# Altium schematic sheet Schema2.SchDoc: Olimex Interface Board
size A4; DrawnBy: Coen de Boer; Engineer: Coen de Boer; Revision: 2005-H
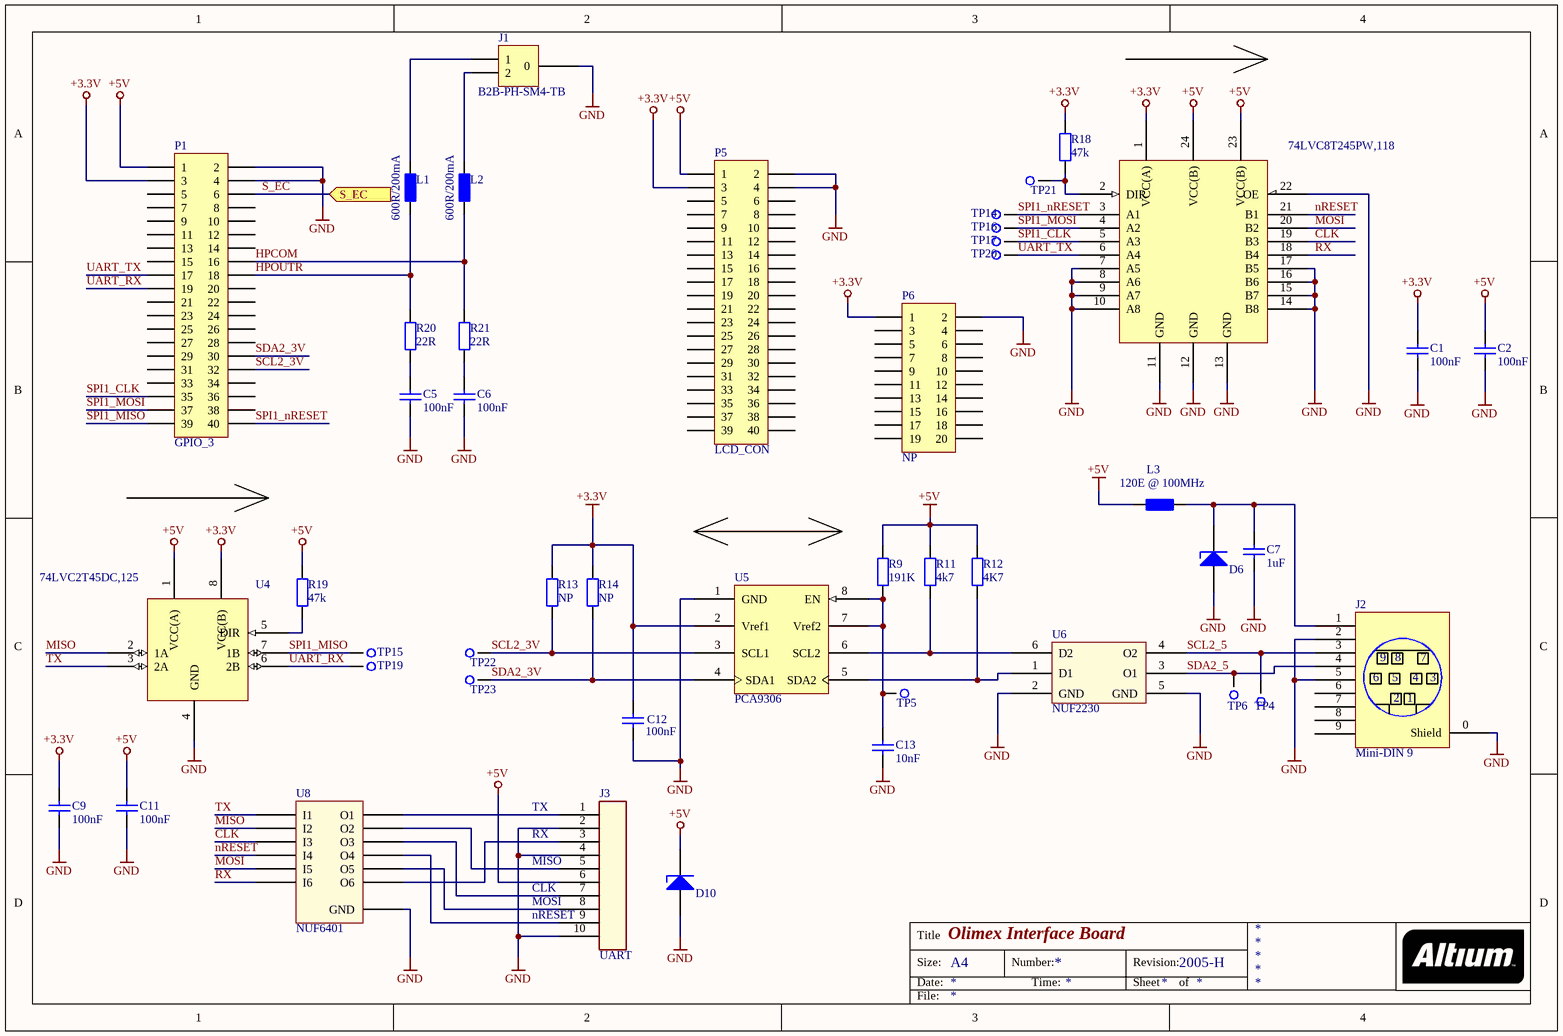
[diagram p0: Schema2.SchDoc]

## Parts
C1  100nF  [C0805 (2012)]
C2  100nF  [C0805 (2012)]
C5  100nF  [C0805 (2012)]
C6  100nF  [C0805 (2012)]
C7  1uF  [CAPC1608X09N]
C9  100nF  [C0805 (2012)]
C11  100nF  [C0805 (2012)]
C12  100nF  [C0805 (2012)]
C13  10nF  [C0805 (2012)]
D6  ESD9X5.0ST5G  [SODFL100X40-2N]  (value not drawn)
D10  ESD9X5.0ST5G  [SODFL100X40-2N]  (value not drawn)
J1  B2B-PH-SM4-TB  [B2B-PH-SM4-TB]
J2  Mini-DIN 9  [MD-90SM]
J3  UART  [BOXHEADER-10P-straight]
L1  600R/200mA  [R0805]
L2  600R/200mA  [R0805]
L3  120E @ 100MHz  [R0603]
P1  GPIO_3  [M50-3152042]
P5  LCD_CON  [M50-3152042]
P6  NP  [HARWIN M20]
R9  191K  [R0805 (2012)]
R11  4k7  [RESC1608X05N]
R12  4K7  [RESC1608X05N]
R13  NP  [R0805 (2012)]
R14  NP  [R0805 (2012)]
R18  47k  [RESC1608X05N]
R19  47k  [RESC1608X05N]
R20  22R  [RESC1608X05N]
R21  22R  [RESC1608X05N]
TP4  2mm  [TESTPOINT 2mm]  (value not drawn)  (no BOM)
TP5  2mm  [TESTPOINT 2mm]  (value not drawn)  (no BOM)
TP6  2mm  [TESTPOINT 2mm]  (value not drawn)  (no BOM)
TP14  2mm  [TESTPOINT 2mm]  (value not drawn)  (no BOM)
TP15  2mm  [TESTPOINT 2mm]  (value not drawn)  (no BOM)
TP16  2mm  [TESTPOINT 2mm]  (value not drawn)  (no BOM)
TP17  2mm  [TESTPOINT 2mm]  (value not drawn)  (no BOM)
TP19  2mm  [TESTPOINT 2mm]  (value not drawn)  (no BOM)
TP20  2mm  [TESTPOINT 2mm]  (value not drawn)  (no BOM)
TP21  2mm  [TESTPOINT 2mm]  (value not drawn)  (no BOM)
TP22  2mm  [TESTPOINT 2mm]  (value not drawn)  (no BOM)
TP23  2mm  [TESTPOINT 2mm]  (value not drawn)  (no BOM)
U3  74LVC8T245PW,118  [TSOP65P640X110-24N]
U4  74LVC2T45DC,125  [TSSOP50P310X100-8N]
U5  PCA9306  [IC SSOP-8]
U6  NUF2230  [SOTFL50P160X60-6N]
U8  NUF6401  [SON50P140X100_HS-13N]

## Ports
S_EC (in)

## Nets
+3.3V: C1.1 C9.1 C12.2 P1.3 P5.3 P6.1 R13.2 R14.2 R18.1 U3.1(VCC(A)) U4.8(VCC(B)) U5.2(Vref1)
+5V: C2.1 C11.1 D10.1(K) J3.6 L3.1 P1.1 P5.1 R9.2 R11.2 R12.2 R19.1 U3.23(VCC(B)) U3.24(VCC(B)) U4.1(VCC(A))
GND: C1.2 C2.2 C5.2 C6.2 C7.1 C9.2 C11.2 C12.1 C13.1 D6.2(A) D10.2(A) J1.0 J2.0(Shield) J2.2 J2.5 J3.2 J3.4 J3.10 P1.2 P1.4 P5.2 P5.4 P6.2 U3.7(A5) U3.8(A6) U3.9(A7) U3.10(A8) U3.11(GND) U3.12(GND) U3.13(GND) U3.14(B8) U3.15(B7) U3.16(B6) U3.17(B5) U3.22(OE) U4.4(GND) U5.1(GND) U6.2(GND) U6.5(GND) U8.13(GND)
CLK: U3.19(B3) U8.3(I3)
HPCOM: L2.1 P1.16 R21.2
HPOUTR: L1.1 P1.18 R20.2
MISO: U4.2(1A) U8.2(I2)
MOSI: U3.20(B2) U8.5(I5)
nRESET: U3.21(B1) U8.4(I4)
RX: U3.18(B4) U8.6(I6)
S_EC: P1.6 ; port S_EC
SCL2_3V: P1.32 R13.1 TP22.1 U5.3(SCL1)
SCL2_5: J2.3 TP4.1 U6.4(O2)
SDA2_3V: P1.30 R14.1 TP23.1 U5.4(SDA1)
SDA2_5: J2.4 TP6.1 U6.3(O1)
SPI1_CLK: P1.35 TP17.1 U3.5(A3)
SPI1_MISO: P1.39 TP15.1 U4.7(1B)
SPI1_MOSI: P1.37 TP16.1 U3.4(A2)
SPI1_nRESET: P1.40 TP14.1 U3.3(A1)
TX: U4.3(2A) U8.1(I1)
UART_RX: P1.19 TP19.1 U4.6(2B)
UART_TX: P1.17 TP20.1 U3.6(A4)
NetC5_1: C5.1 R20.1
NetC6_1: C6.1 R21.1
NetC7_2: C7.2 D6.1(K) J2.1 L3.2
NetC13_2: C13.2 R9.1 TP5.1 U5.7(Vref2) U5.8(EN)
NetJ1_1: J1.1 L1.2
NetJ1_2: J1.2 L2.2
NetJ3_1: J3.1 U8.12(O1)
NetJ3_3: J3.3 U8.7(O6)
NetJ3_5: J3.5 U8.11(O2)
NetJ3_7: J3.7 U8.10(O3)
NetJ3_8: J3.8 U8.8(O5)
NetJ3_9: J3.9 U8.9(O4)
NetR11_1: R11.1 U5.6(SCL2) U6.6(D2)
NetR12_1: R12.1 U5.5(SDA2) U6.1(D1)
NetR18_2: R18.2 TP21.1 U3.2(DIR)
NetR19_2: R19.2 U4.5(DIR)

Not connected (* = marked no-connect by the designer): J2 6 7 8 9; P1 5 7 8 9 10 11 12 13 14 15 20 21 22 23 24 25 26 27 28 29 31 33 34 36 38; P5 5 6 7 8 9 10 11 12 13 14 15 16 17 18 19 20 21 22 23 24 25 26 27 28 29 30 31 32 33 34 35 36 37 38 39 40; P6 3 4 5 6 7 8 9 10 11 12 13 14 15 16 17 18 19 20

## Notes on the sheet
- RX
- TX
- (near J3) MISO
- (near J3) CLK
- (near J3) MOSI
- (near J3) nRESET
- Title
- Size:
- Date:
- A4
- Number:
- Time:
- Revision:
- Sheet
- of
- File:

## Library data of the parts
C1 C2 C5 C6 C9 C11 C12 = Cap 100nF X7R 0805: Cap 100nF X7R 0805 10% 100V; Mfg: AVX; Mfg code: 08051C104K4T2A; Faber ItemCode: -; Max soldering temp: -; Remarks: -; Supplier: Farnell; Supplier code: 1833888; Value: 100nF; SMD: Yes
C7 = 1uF/10V/0603: CAP CER 1UF 10V 10% X5R 0603; Manufacturer: Murata Electronics North America; Manufacturer Part Number: GRM188R61A105KA61D; Capacitance: 1.0µF; Value: 1uF; Voltage - Rated: 10V; Supplier 1: Digi-Key; Supplier Part Number 1: 490-1543-6-ND; RoHS: RoHS Compliant; Category: Capacitors; Stock 1: 649155; Pricing 1: 1=0.15, 10=0.063, 50=0.0344, 100=0.0291, 250=0.02372, 500=0.02032, 1000=0.01583 (EUR); Tolerance: ±10%; Temperature Coefficient: X5R; Mounting Type: Surface Mount, MLCC; Operating Temperature: -55°C ~ 85°C; Applications: General Purpose; Ratings: -; Package / Case: 0603 (1608 Metric); Size / Dimension: 0.063" L x 0.031" W (1.60mm x 0.80mm); Height - Seated (Max): -; Thickness (Max): 0.035" (0.90mm); Lead Spacing: -; Features: -; Packaging: Digi-Reel®; Lead Style: -; ComponentLink1URL: http://psearch.murata.com/capacitor/product/GRM188R61A105KA61#.pdf; ComponentLink1Description: http://psearch.murata.com/capacitor/product/GRM188R61A105KA61#.pdf; Mfg: Murata Electronics North America; Mfg code: GRM188R61A105KA61D
C13 = Cap 10nF X7R 0805: Cap 10nF X7R 0805 10% 100V; Mfg: AVX; Mfg code: 08051C103K4Z2A; Faber ItemCode: -; Max soldering temp: -; Remarks: -; Supplier: Farnell; Supplier code: 1833850; SMD: Yes; Value: 10nF
D6 D10 = ESD9X5.0ST5G: TVS DIODE 5VWM 12.3VC SOD923; Mfg: ON Semiconductor; Type: Zener; Unidirectional Channels: 1; Voltage - Reverse Standoff (Typ): 5V (Max); Voltage - Breakdown (Min): 6.2V; Voltage - Clamping (Max) @ Ipp: 12.3V; Current - Peak Pulse (10/1000µs): 8.7A (8/20µs); Power - Peak Pulse: 107W; Power Line Protection: No; Capacitance @ Frequency: 65pF @ 1MHz; Supplier 1: Digi-Key; Supplier Part Number 1: ESD9X5.0ST5GOSTR-ND; Mfg code: ESD9X5.0ST5G; RoHS: RoHS Compliant; Category: Circuit Protection; Stock: 40000; Pricing: 8000=0.02337, 16000=0.02032, 24000=0.01829, 56000=0.01626, 200000=0.01351 (EUR); Packaging: Tape & Reel (TR); Bidirectional Channels: -; Applications: General Purpose; Operating Temperature: -55°C ~ 150°C (TJ); Mounting Type: Surface Mount; Package / Case: SOD-923; Supplier Device Package: SOD-923; ComponentLink1URL: http://www.onsemi.com/pub_link/Collateral/ESD9X3.3ST5G-D.PDF; ComponentLink1Description: http://www.onsemi.com/pub_link/Collateral/ESD9X3.3ST5G-D.PDF
J1 = Header 2_1: JST B2B-PH-SM4-TB; Mfg: JST; Mfg code: B2B-PH-SM4-TB; Manufacturer: JST; Manufacturer Part Number: B2B-PH-SM4-TB
J2 = Mini-DIN 9: Mfg: CUI Inc.; Connector Type: Receptacle, Female Sockets; Number of Positions: 9; Current Rating: 1A, 2A; Voltage - Rated: 100VAC, 12VDC; Supplier 1: Digi-Key; Supplier Part Number 1: CP-2290-ND; Mfg code: MD-90SM; RoHS: RoHS Compliant; Category: Connectors, Interconnects; Stock: 370; Pricing: 1=1.81, 10=1.505, 100=1.1146, 500=0.89166, 1000=0.80808 (EUR); Packaging: Bulk; Shell Size - Insert: Mini DIN; Shell Size, MIL: -; Mounting Type: Through Hole, Right Angle; Termination: Solder; Fastening Type: Push-Pull; Orientation: Keyed; Ingress Protection: -; Shell Material, Finish: Polybutylene Terephthalate (PBT); Contact Finish: Silver; Features: Shielded; Contact Finish Thickness: -; Operating Temperature: -40°C ~ 85°C; ComponentLink1URL: http://www.cui.com/product/resource/digikeypdf/md-xxsm_series.pdf; ComponentLink1Description: http://www.cui.com/product/resource/digikeypdf/md-xxsm_series.pdf
J3 = Library_CON-0019: RO CONN PR HDR BOX 10p; Mfg: Wurth; Mfg code: 61201021621; Supplier: Farnell; Supplier code: 1642019
L1 L2 = Ferriet Bead 600E: Mfg: Fair-rite; Mfg code: 2508056017Y2; Farnell code: 1838838RL; Supplier: Farnell; Supplier code: 1838838RL
L3 = Ferriet Bead 120E: FERRIET BLM18PG121SN1D 0603 MURATA; Info: Resistor; ID: -; Faber ItemCode: -; Value: 120E @ 100MHz; Mfg: Murata; Mfg code: BLM18PG121SN1D
P1 P5 = MHDR2X20: HARWIN - M50-3152042 - SOCKET, DUAL ENTRY, SMT, 40WAY; LatestRevisionDate: 17-Jul-2002; LatestRevisionNote: Re-released for DXP Platform.; Publisher: Altium Limited; Farnell code:: 1189109; Mfg: Harwin; Mfg code: M50-3152042; Supplier: Farnell; Supplier code: 1189109
P6 = MHDR2X10: HARWIN M20; LatestRevisionDate: 17-Jul-2002; LatestRevisionNote: Re-released for DXP Platform.; Publisher: Altium Limited
R9 = Res 191K 0805: Res 191K 0805 1% 125mW; Mfg: VISHAY DRALORIC; Mfg code: CRCW0805191KFKEA; Faber ItemCode: -; Max soldering temp: -; Remarks: -; Supplier: Farnell; Supplier code: 2139049; Value: 191K; SMD: Yes
R11 R12 = Res 4.7K 0805: RES SMD 4.7K OHM 1% 1/10W 0603; Manufacturer: Vishay Dale; Manufacturer Part Number: CRCW06034K70FKEA; Power (Watts): 0.1W, 1/10W; Temperature Coefficient: ±100ppm/°C; Supplier 1: Digi-Key; Supplier Part Number 1: 541-4.70KHDKR-ND; RoHS: RoHS Compliant; Category: Resistors; Stock 1: 396545; Pricing 1: 1=0.1, 10=0.029, 25=0.0212, 50=0.0162, 100=0.0118, 250=0.00904, 500=0.00722, 1000=0.00532 (EUR); Packaging: Digi-Reel®; Part Status: Active; Resistance (Ohms): 4.7k; Tolerance: ±1%; Composition: Thick Film; Features: Automotive AEC-Q200; Operating Temperature: -55°C ~ 155°C; Package / Case: 0603 (1608 Metric); Supplier Device Package: 0603; Size / Dimension: 0.063" L x 0.033" W (1.60mm x 0.85mm); Height - Seated (Max): 0.020" (0.50mm); Number of Terminations: 2; Failure Rate: -; ComponentLink1URL: http://www.vishay.com/docs/20035/dcrcwe3.pdf; ComponentLink1Description: http://www.vishay.com/docs/20035/dcrcwe3.pdf
R13 R14 = Res 4.7K 0805: Res 4.7K 0805 1% 100mW; Mfg: MULTICOMP; Mfg code: MC 0.1W 0805 1% 4K7; Faber ItemCode: -; Max soldering temp: -; Remarks: -; Supplier: Farnell; Supplier code: 9333266; Value: 4.7K; SMD: Yes
R18 R19 = 47k/0603: RES 47.0K OHM 1/10W 1% 0603 SMD; Manufacturer: Vishay Dale; Manufacturer Part Number: CRCW060347K0FKEA; Power (Watts): 0.1W, 1/10W; Temperature Coefficient: ±100ppm/°C; Supplier 1: Digi-Key; RoHS: RoHS Compliant; Category: Resistors; Stock 1: 78114; Pricing 1: 10=0.069, 50=0.037, 200=0.02135, 1000=0.01454 (EUR); Resistance (Ohms): 47k; Composition: Thick Film; Features: Automotive AEC-Q200 Qualified; Tolerance: ±1%; Package / Case: 0603 (1608 Metric); Supplier Device Package: 0603 (1608 Metric); Size / Dimension: 0.061" L x 0.033" W (1.55mm x 0.85mm); Height: 0.020" (0.50mm); Number of Terminations: 2; Packaging: Digi-Reel®; ComponentLink1URL: http://www.vishay.com/doc?20035; ComponentLink1Description: http://www.vishay.com/doc?20035; Supplier Part Number 1: 541-47.0KHDKR-ND; Mfg: Vishay Dale; Mfg code: CRCW060347K0FKEA; Supplier: Farnell; Supplier code: 2122577
R20 R21 = 2.2k/0603: RES 22R OHM 63mW 1% 0603 SMD; Mfg: MULTICOMP; Mfg code: MC0063W0603122R; Supplier: Farnell; Supplier code: 2130723
TP4-TP6 TP14-TP17 TP19-TP23 = Testpoint, 2mm, round: Remarks: Not a component; Faber ItemCode: -; Mfg: -; Mfg code: -; Value: -; Supplier: -; Supplier code: -; Max soldering temp: -
U3 = 74LVC8T245PW,118: 8-bit translaing transceiver; Mfg: NXP; Mfg code: 74LVC8T245PW,118; Supplier: Farnell; Supplier code: 2444917
U4 = 74LVC2T45DC,125: 2-bit translaing transceiver; Mfg: NXP; Mfg code: 74LVC2T45DC,125; Supplier: Farnell; Supplier code: 2444915
U5 = IC PCA9306: IC PCA9306 Voltage Level translator; Mfg: TEXAS INSTRUMENTS; Mfg code: PCA9306DCTR; Faber ItemCode: -; Max soldering temp: -; Remarks: -; SMD: Yes; Supplier: Farnell; Supplier code: 1470936; Value: -
U6 = NUF2230: Mfg: ON Semiconductor; Mfg code: NUF2230XV6T1G; Filter Order: 2nd; Number of Channels: 2; Center / Cutoff Frequency: 125MHz (Cutoff); Attenuation Value: 30dB @ 800MHz ~ 900MHz; Resistance - Channel (Ohms): 100; Values: R = 100 Ohms, C = 16pF; ESD Protection: Yes; Supplier 1: Digi-Key; Supplier Part Number 1: NUF2230XV6T1GOSCT-ND; RoHS: RoHS Compliant; Category: Filters; Stock: 3048; Pricing: 1=0.27, 10=0.252, 25=0.2404, 50=0.2326, 100=0.2248, 250=0.21316, 500=0.17828, 1000=0.13836 (EUR); Packaging: Cut Tape (CT); Type: Low Pass; Technology: RC (Pi); Current: -; Operating Temperature: -40°C ~ 85°C; Applications: Data Lines for Mobile Devices; Package / Case: SOT-563, SOT-666; Size / Dimension: 0.063" L x 0.047" W (1.60mm x 1.20mm); Height: 0.024" (0.60mm); ComponentLink1URL: http://www.onsemi.com/pub_link/Collateral/NUF2230XV6-D.PDF; ComponentLink1Description: http://www.onsemi.com/pub_link/Collateral/NUF2230XV6-D.PDF
U8 = NUF6401: Mfg: ON Semiconductor; Mfg code: NUF6401MNT1G; Filter Order: 2nd; Number of Channels: 6; Center / Cutoff Frequency: 110MHz (Cutoff); Attenuation Value: 30dB @ 800MHz ~ 3GHz; Resistance - Channel (Ohms): 100; Values: R = 100 Ohms, C = 17pF; ESD Protection: Yes; Supplier 1: Digi-Key; Supplier Part Number 1: NUF6401MNT1GOSTR-ND; RoHS: RoHS Compliant; Category: Filters; Stock: 6000; Pricing: 3000=0.13931, 6000=0.13111, 15000=0.12292, 30000=0.11472 (EUR); Packaging: Tape & Reel (TR); Type: Low Pass; Technology: RC (Pi); Current: -; Operating Temperature: -40°C ~ 85°C; Applications: Data Lines for Mobile Devices; Package / Case: 12-VFDFN Exposed Pad; Size / Dimension: 0.118" L x 0.053" W (3.00mm x 1.35mm); Height: 0.039" (1.00mm); ComponentLink1URL: http://www.onsemi.cn/pub_link/Collateral/NUF6401-D.PDF; ComponentLink1Description: http://www.onsemi.cn/pub_link/Collateral/NUF6401-D.PDF